# EAGLE design AEMLIC V2.1 (EAGLE 9.6.2)
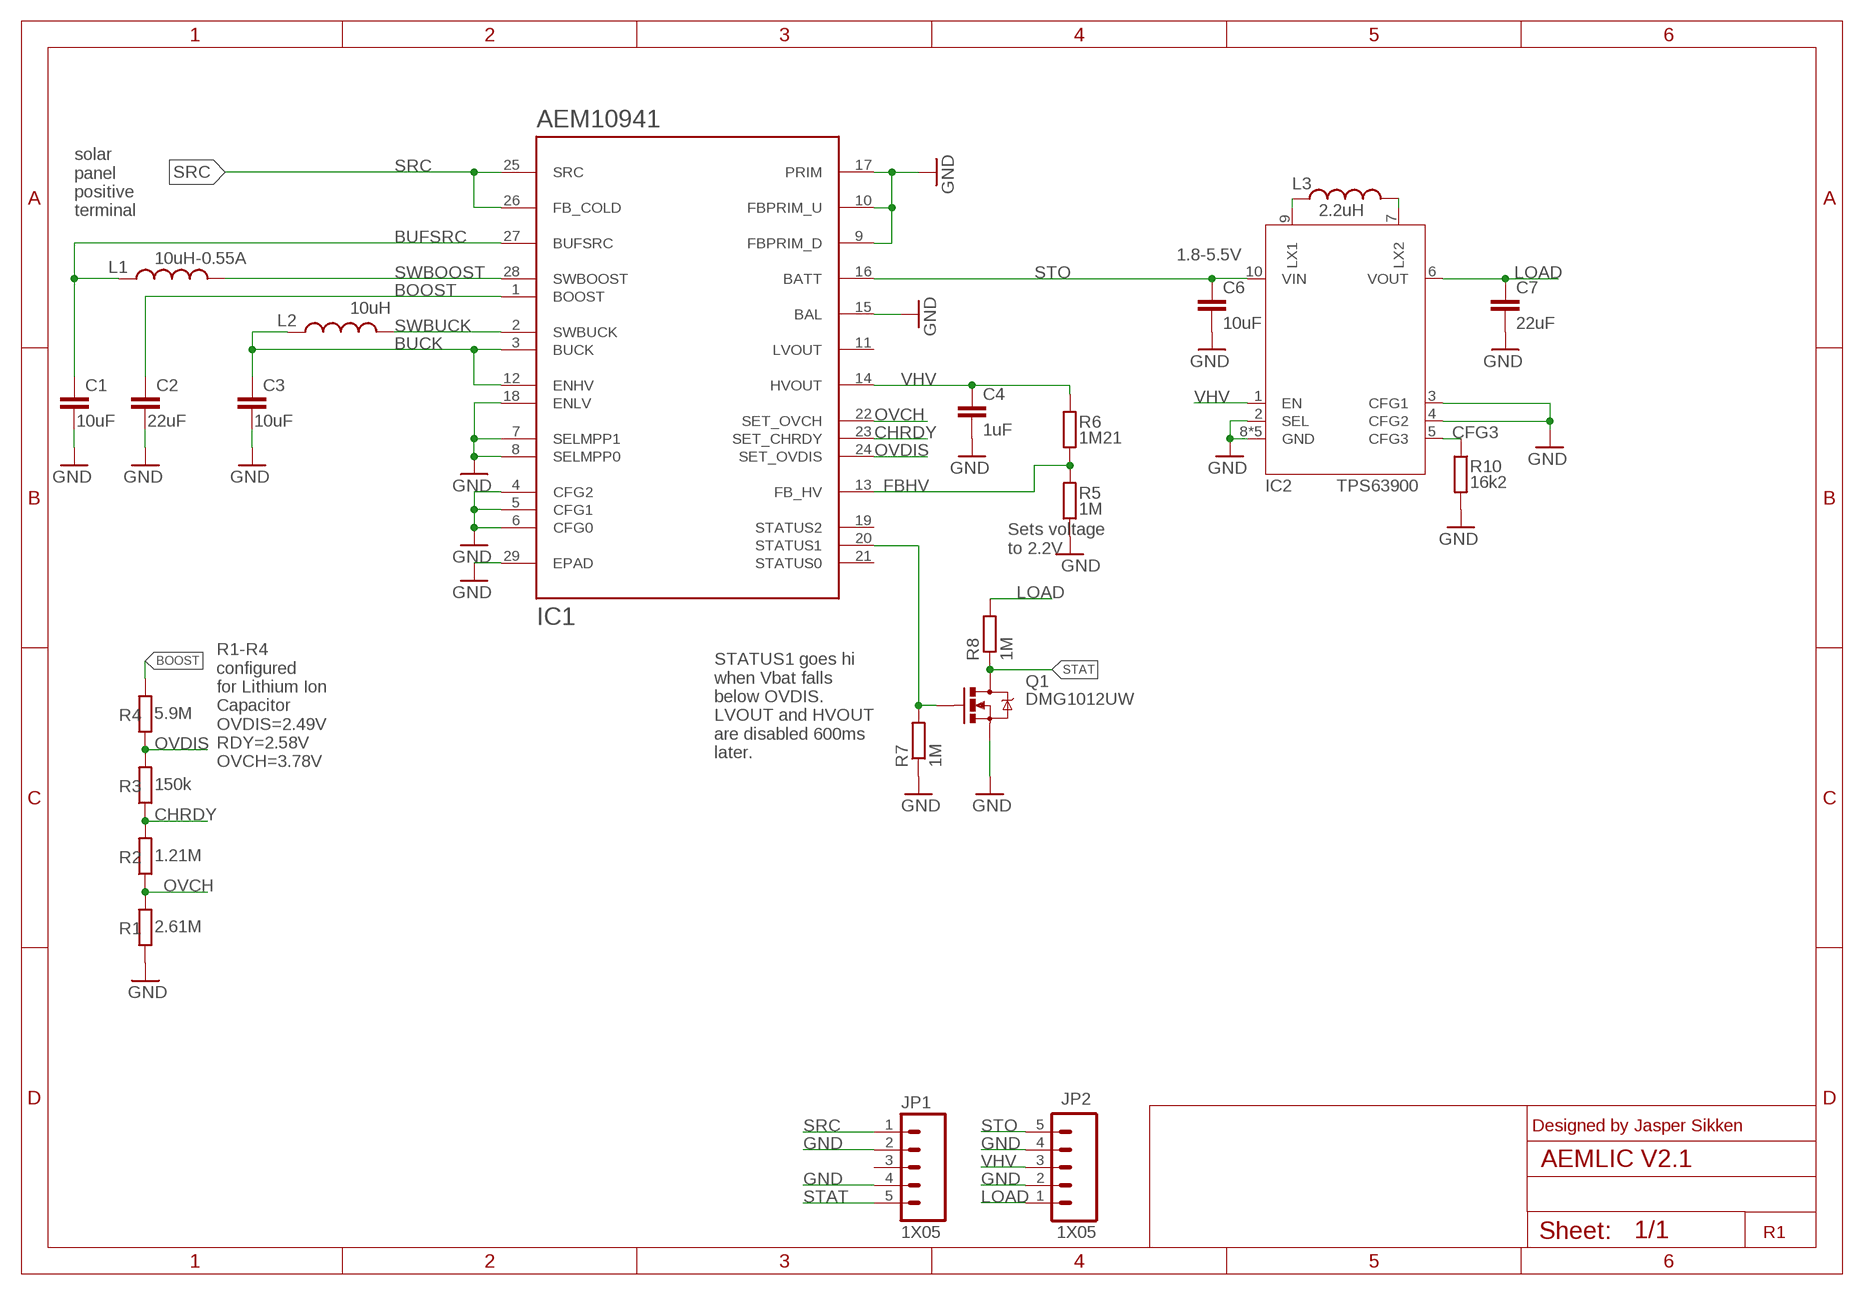
[diagram p0: schematic, sheet 1]

## Parts
C1  10uF  C0603_10UF  [C0603]
C2  22uF  C0603_22UF  [C0603]
C3  10uF  C0603_10UF  [C0603]
C4  1uF  C0603_10UF  [C0603]
C6  10uF  C0603_10UF  [C0603]
C7  22uF  C0603_22UF  [C0603]
IC1  AEM10941  [QFN50P505X505X90-28]
IC2  TPS63900  [WSON10]
JP1  1X05  [1X05_2.54MM_ROUND_NOSILK]
JP2  1X05  [1X05_2.54MM_ROUND_NOSILK]
L1  10uH-0.55A  L3.9X3.9_10UH_0.55A  [LPS4012]
L2  10uH  L0603_10UH  [L0603]
L3  2.2uH  L2  [L_1008_[2520]]
Q1  DMG1012UW  MOSFET-N-CHANNEL_DMG1012UW  [SOT323]
R1  2.61M  R0402_1M  [R0402]
R2  1.21M  R0402_1M  [R0402]
R3  150k  R0402_1M  [R0402]
R4  5.9M  R0402_1M  [R0402]
R5  1M  R0402_1M  [R0402]
R6  1M21  R0402_1M  [R0402]
R7  1M  R0402_1M  [R0402]
R8  1M  R0402_1M  [R0402]
R10  16k2  R0402_10K  [R0402]

## Nets
BOOST: C2.1 IC1.1(BOOST) R4.2
BUCK: C3.1 IC1.3(BUCK) IC1.12(ENHV) L2.1
BUFSRC: C1.1 IC1.27(BUFSRC) L1.1
CFG3: IC2.5(CFG3) R10.1
CHRDY: IC1.23(SET_CHRDY) R2.2 R3.1
FBHV: IC1.13(FB_HV) R5.2 R6.1
GND: C1.2 C2.2 C3.2 C4.2 C6.2 C7.2 IC1.4(CFG2) IC1.5(CFG1) IC1.6(CFG0) IC1.7(SELMPP1) IC1.8(SELMPP0) IC1.9(FBPRIM_D) IC1.10(FBPRIM_U) IC1.15(BAL) IC1.17(PRIM) IC1.18(ENLV) IC1.29(EPAD) IC2.2(SEL) IC2.3(CFG1) IC2.4(CFG2) IC2.8(GND) IC2.29(GND) IC2.P$2(GND) IC2.P$4(GND) IC2.P$5(GND) JP1.2 JP1.4 JP2.2 JP2.4 Q1.2(S) R1.1 R5.1 R7.1 R10.2
LOAD: C7.1 IC2.6(VOUT) JP2.1 R8.2
N$2: IC2.9(LX1) L3.1
N$3: IC2.7(LX2) L3.2
OVCH: IC1.22(SET_OVCH) R1.2 R2.1
OVDIS: IC1.24(SET_OVDIS) R3.2 R4.1
SRC: IC1.25(SRC) IC1.26(FB_COLD) JP1.1
STAT: JP1.5 Q1.3(D) R8.1
STATUS1: IC1.20(STATUS1) Q1.1(G) R7.2
STO: C6.1 IC1.16(BATT) IC2.10(VIN) JP2.5
SWBOOST: IC1.28(SWBOOST) L1.2
SWBUCK: IC1.2(SWBUCK) L2.2
VHV: C4.1 IC1.14(HVOUT) IC2.1(EN) JP2.3 R6.2
Unconnected: IC1.11(LVOUT) IC1.19(STATUS2) IC1.21(STATUS0) JP1.3

## Notes on the sheet
- solar
  panel
  positive
  terminal
- 1.8-5.5V
- Sets voltage 
  to 2.2V
- STATUS1 goes hi 
  when Vbat falls 
  below OVDIS. 
  LVOUT and HVOUT
  are disabled 600ms
  later.
- R1-R4 
  configured 
  for Lithium Ion 
  Capacitor
  OVDIS=2.49V
  RDY=2.58V
  OVCH=3.78V
- Designed by Jasper Sikken
- R1

## Library data of the parts
C1 C3 = TSEM:C: Non-polarized capacitor; FARNELL_OC: 2113070; MF: KEYSTONE; MPN: 1049P; OC_NEWARK: 53Y2625
C2 = TSEM:C: Non-polarized capacitor; FARNELL_OC: 2426957; MF: TDK; MPN: CGA5L1X7S1A226M160AC; OC_NEWARK: 71AH2845; VALUE: 22uF 10V
C4 = TSEM:C: Non-polarized capacitor; FARNELL_OC: 2113070; MF: Taiyo Yuden; MPN: LMK107BBJ106MALT; VALUE: 10uF
C6 = JaspersEagleLibrary:C: Non-polarized capacitor; FARNELL_OC: 2113070; MF: Taiyo Yuden; MPN: LMK107BBJ106MALT
C7 = JaspersEagleLibrary:C: Non-polarized capacitor; FARNELL_OC: 2426957; MF: Murata; MPN: GRM188R61A226ME15D; VALUE: 22uF 10V
IC1 = TSEM:AEM10941: Ambient Energy Manager from e-peas; OC_NEWARK: unknown
IC2 = JaspersEagleLibrary:TPS63900: TPS63900 1.8-V to 5.5-V, 75-nA IQ Buck-boost Converter with Input Current Limit and DVS
JP1 JP2 = TSEM:1X05; OC_NEWARK: unknown
L1 = TSEM:L: Inductor; FARNELL_OC: 2408076; MF: BOURNS; MPN: SRN2009T-100M; OC_NEWARK: 43AC9502
L2 = TSEM:L: Inductor; FARNELL_OC: 2215635; MF: TAIYO YUDEN; MPN: CK2125100M-T; OC_NEWARK: 25AC6883
L3 = TSEM:L: Inductor; MF: Murata; MPN: DFE252012F-2R2M=P2
Q1 = TSEM:MOSFET-N-CHANNEL: Mosfet N channel; FARNELL_OC: 2061403; OC_NEWARK: unknown
R1-R4 R6 = TSEM:R: Resistor; FARNELL_OC: 2502499; OC_NEWARK: unknown; VALUE: 1M
R5 R7 R8 = TSEM:R: Resistor; FARNELL_OC: 2502499; OC_NEWARK: unknown
R10 = JaspersEagleLibrary:R: Resistor; FARNELL_OC: 2447096; OC_NEWARK: unknown; VALUE: 10k

## Board
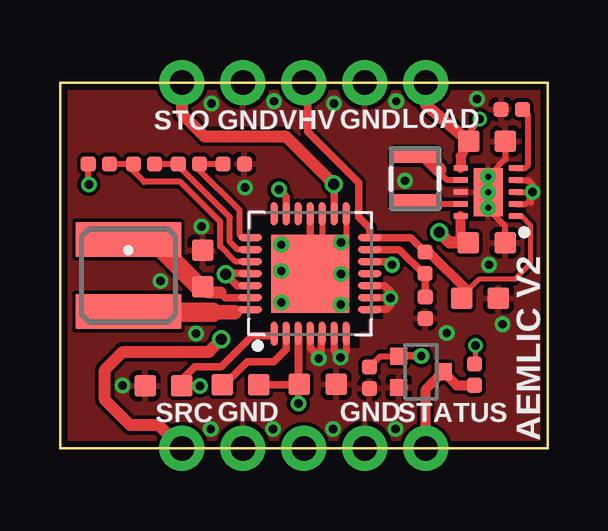
[diagram p1: board, top side]
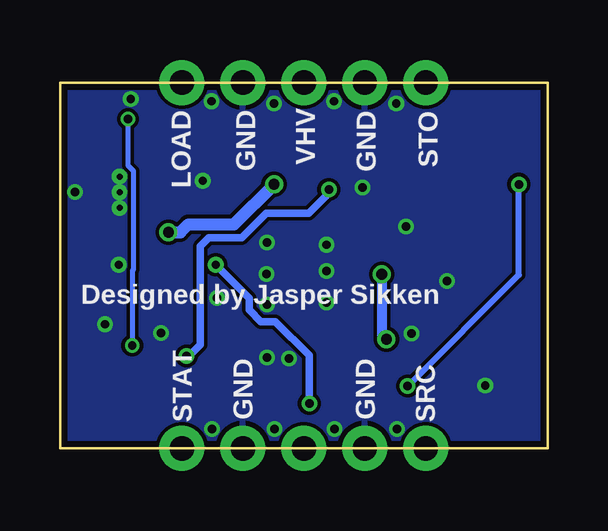
[diagram p2: board, bottom side, seen from below]

Size 20.32 x 15.24 mm. Coordinates in mm from the lower left corner, seen from the top.
Outline: 0,0 0,15.24 20.32,15.24 20.32,0 0,0
Copper layers (1*16): Top 0.018mm / dielectric 1.55mm / Bottom 0.018mm
Design rules "eC_2Layer_PClass6_BaseCopperO18_eCDefault *": minimum track width 0.15mm, minimum drill 0.35mm, track to track 0.15mm, track to pad 0.15mm, pad to pad 0.15mm, via to via 0.15mm, smd to smd 0mil, copper to edge 0.25mm, drill to drill 0.35mm, minimum pad ring 0.175mm, minimum via ring 0.125mm, stop-mask expansion 0mil, vias tented up to drill 0.45mm, thermal gap 0.2mm
tRestrict: area 12.4,5.4 to 13.4,7; area 10.2,4.2 to 11.4,5.2; area 11.7,9.7 to 12.3,10.4; area 11.3,4.2 to 12.5,5.2; area 10.2,9.3 to 11.2,10.4; area 18.4,10 to 19.3,11.4

### Footprints (pad centres in the part's own frame; a part is rotated, then mirrored left to right if it is on the bottom)
C0603 = smd 0.889 x 0.889: 1 -0.762,0; 2 0.762,0
QFN50P505X505X90-28 = smd 0.977 x 0.292: 1 -2.486,1.5; 2 -2.486,1; 3 -2.486,0.5; 4 -2.486,0; 5 -2.486,-0.5; 6 -2.486,-1; 7 -2.486,-1.5; 15 2.486,-1.5; 16 2.486,-1; 17 2.486,-0.5; 18 2.486,0; 19 2.486,0.5; 20 2.486,1; 21 2.486,1.5 | smd 0.292 x 0.977: 8 -1.5,-2.486; 9 -1,-2.486; 10 -0.5,-2.486; 11 0,-2.486; 12 0.5,-2.486; 13 1,-2.486; 14 1.5,-2.486; 22 1.5,2.486; 23 1,2.486; 24 0.5,2.486; 25 0,2.486; 26 -0.5,2.486; 27 -1,2.486; 28 -1.5,2.486 | smd 3.25 x 3.25: 29 0,0
WSON10 = smd 0.6 x 0.25: 1 -1.15,1; 2 -1.15,0.5; 3 -1.15,0; 4 -1.15,-0.5; 5 -1.15,-1; 6 1.15,-1; 7 1.15,-0.5; 8 1.15,0; 9 1.15,0.5; 10 1.15,1 | smd 1.2 x 2: 29 0,0 | drill 0.25 pad 0.65: P$2 0,0; P$4 0,-0.65; P$5 0,0.65
1X05_2.54MM_ROUND_NOSILK = drill 1.016 pad 1.88: 1 0,0; 2 2.54,0; 3 5.08,0; 4 7.62,0; 5 10.16,0
LPS4012 = smd 1.45 x 4.4: 1 -1.5,0; 2 1.5,0
L0603 = smd 0.889 x 0.889: 1 -0.762,0; 2 0.762,0
L_1008_[2520] = smd 0.6 x 2: 1 -0.95,0; 2 0.95,0
SOT323 = smd 0.7 x 0.7: 1 -0.65,-0.925; 2 0.65,-0.925; 3 0,0.925
R0402 = smd 0.635 x 0.635: 1 -0.445,0; 2 0.445,0

### Placement (x,y rotation side)
C1  5.95,7.5 90 top
C2  4.31,2.6 180 top
C3  10.74,2.66 0 top
C4  17.5,6.25 0 top
C6  17.78,8.57 0 top
C7  17.8,12.8 0 top
IC1  10.42,7.28 90 top
IC2  17.84,10.67 180 top
JP1  5.08,0 0 top
JP2  15.24,15.24 180 top
L1  2.85,7.2 270 top
L2  7.52,2.64 180 top
L3  14.8,11.24 90 top
Q1  15.04,3.19 270 top
R1  7.24,11.85 180 top
R2  5.37,11.85 180 top
R3  3.5,11.85 180 top
R4  1.62,11.85 180 top
R5  15.22,5.86 90 top
R6  15.21,7.73 90 top
R7  12.89,2.94 90 top
R8  17.27,3.07 90 top
R10  18.82,14.12 180 top

### Tracks (layer width: path | path; a pad name or v marks a point on that pad's centre or on a via)
BOOST  (via drill 0.35 pad 0.65)
  Top 0.254: v1.2,11 1.18,11.02 R4.2
  Top 0.305: 8.92,4.41 IC1.1 8.83,4.7 8.02,4.7 6.72,3.4 5.61,3.4 5.07,2.86 C2.1 v5.83,2.6
  Bottom 0.254: v5.83,2.6 1.2,7.23 v1.2,11
BUCK  (via drill 0.35 pad 0.65)
  Top 0.254: v9.93,1.87 9.93,2.88 9.94,2.89
  Top 0.305: v13.83,7.65 13.7,7.78 IC1.12 | 9.94,2.89 9.94,4.77 IC1.3 9.92,2.72 C3.1 9.96,2.64 L2.1
  Bottom 0.305: v9.93,1.87 v9.94,1.88 9.94,3.87 11.35,5.28 11.95,5.28 12.44,5.77 12.44,6.26 v13.83,7.65
BUFSRC
  Top 0.305: IC1.27 6.89,6.28 6.68,6.49
  Top 0.508: 6.68,6.49 6.19,6.49 C1.1
  Top 0.813: L1.1 3.85,8.7 5.81,6.74 C1.1
CFG3
  Top 0.254: IC2.5 19.37,11.67 19.5,11.8 19.5,13.88 R10.1
CHRDY
  Top 0.254: IC1.23 7.4,8.28 7.08,8.61 7.08,9.62 4.93,11.77 R2.2 R3.1
FBHV
  Top 0.305: 15.16,6.36 R5.2 15.21,6.31 R6.1 15.17,7.24 14.13,8.28 IC1.13
GND  (via drill 0.35 pad 0.65)
  Top 0.152: 10.04,7.85 9.57,7.38 v9.22,7.38 | 10.04,7.85 10.04,7.66 IC1.29 10.42,7.48 10.04,7.85
  Top 0.203: v19.69,10.68 19.63,10.62 19.63,10.21 | 19.89,10.68 19.38,10.17
  Top 0.254: C7.2 18.56,12.04 IC2.P$4 | C6.2 18.54,9.26 17.84,9.96 IC2.P$5 | IC2.4 19.5,11.17 19.69,10.98 v19.69,10.68 19.72,10.68 | IC2.3 19.71,10.67 19.72,10.68 | 19.89,10.68 19.72,10.68 | IC2.2 19.38,10.17 | IC1.15 11.92,8.79 v11.7,8.57 | IC1.29 10.42,7.87 11.12,8.57 10.92,8.77 IC1.17
  Top 0.3: IC1.7 11.92,4.01 v11.69,3.78
  Top 0.305: 11.42,6.28 IC1.29 | IC1.4 10.42,4.18 10.78,3.82 v10.78,3.75 10.89,3.86 10.89,4.76 IC1.5 | IC1.6 11.42,4.06 v11.69,3.79 v11.69,3.78 | IC1.18 10.42,8.66 10.24,8.48 v9.22,8.48 | IC1.10 13.52,6.78 13.77,6.53 v13.77,6.27 | IC1.9 v13.76,6.28 v13.77,6.27 | v13.77,6.27 13.77,5.97 13.6,5.8 12.93,5.8 IC1.8
  Top 0.508: IC1.29 v11.7,8.57
  other vias: 9.22,6.08 11.7,6 11.71,7.27 7.71,10.86 2.6,2.62 5.67,4.78 4.19,6.97 5.9,9.25 8.91,14.46 6.31,14.36 11.41,14.36 14.01,14.46 6.28,0.81 8.88,0.81 11.38,0.81 13.98,0.81 17.37,14.56 18.44,5.17 17.87,7.65 14.37,11.15 16.11,4.81
  pour Top: 0,15.24 20.32,15.24 20.32,0 0,0
  pour Bottom: 0,15.24 20.32,15.24 20.32,0 0,0
LOAD  (via drill 0.35)
  Top 0.203: C7.1 17.04,13.18 17.49,13.63 v17.49,13.72 | v17.31,4.29 17.31,3.55 R8.2
  Top 0.406: C7.1 16.69,12.17 IC2.6
  Top 0.508: JP2.1 15.24,14.32 C7.1
  Bottom 0.203: v17.49,13.72 17.49,11.79 17.26,11.56 17.26,7.45 17.3,7.41 v17.3,4.29 v17.31,4.29
N$2
  Top 0.254: IC2.9 14.92,10.17 L3.1
N$3
  Top 0.254: IC2.7 16.13,11.17 15.8,11.5 15.8,11.6
  Top 0.61: 15.11,12.19 L3.2 15.21,12.19 15.8,11.6
OVCH
  Top 0.254: IC1.22 7.59,8.78 7.48,8.89 7.48,9.92 5.7,11.7 5.7,11.74 R2.1 R1.2
OVDIS
  Top 0.254: IC1.24 7.31,7.78 6.67,8.42 6.67,9.43 5,11.1 3.5,11.1 3,11.6 3,11.79 3,11.8 | 3,11.8 R3.2 | R4.1 2.95,11.85 3,11.8
SRC  (via drill 0.45 pad 0.75)
  Top 0.305: IC1.25 6.95,7.29 v6.91,7.25 7.38,6.78 IC1.26
  Top 0.508: JP1.1 4.11,0.97 2.93,0.97 1.87,2.03 1.87,3.27 2.62,4.02 6.2,4.02 v6.72,4.54
  Bottom 0.406: v6.91,7.25 6.91,4.73 v6.72,4.54
STAT
  Top 0.406: JP1.5 15.24,2.46 Q1.3 16.53,2.63 R8.1
STATUS1  (via drill 0.35 pad 0.65)
  Top 0.254: R7.2 13.34,3.84 Q1.1
  Top 0.305: IC1.20 9.42,10.48 v9.12,10.78 | v15.05,3.85 14.13,3.85 Q1.1
  Bottom 0.305: v9.12,10.78 9.12,10.62 9.95,9.79 11.73,9.79 12.75,8.77 14.12,8.77 14.48,8.42 14.48,4.32 15,3.8 v15.05,3.85
STO  (via drill 0.45 pad 0.75)
  Top 0.305: IC1.16 11.42,10.98 v11.4,11 | C6.1 16.69,8.9
  Top 0.406: 16.69,8.9 IC2.10
  Top 0.508: JP2.5 5.08,13.94 6.02,13 9.4,13 v11.4,11 | C6.1 16.23,8.57 v15.8,9
  Bottom 0.508: v15.8,9 15.3,9 14.97,9.33 13.07,9.33 v11.4,11
SWBOOST
  Top 0.305: L1.2 2.82,5.67 | IC1.28 7.39,5.78 7.28,5.67
  Top 0.61: 7.28,5.67 6.36,5.67
  Top 0.813: 6.36,5.67 2.82,5.67
SWBUCK
  Top 0.305: L2.2 6.84,2.64 7.8,3.6 8.9,3.6 9.42,4.12 IC1.2
VHV
  Top 0.203: IC2.1 19.23,9.67 19.6,9.3 19.6,7.7 18.94,7.04 17.44,7.04 16.93,6.53
  Top 0.305: JP2.3 10.33,15.07 10.33,13.18 12.45,11.06 12.45,9.63 12.91,9.17 IC1.14 14.6,8.78 R6.2 | 16.93,6.53 C4.1
  Top 0.406: C4.1 16.93,6.62 15.37,8.18 R6.2

### Text on the board
tPlace: STO | GND | VHV | GND | LOAD | SRC | GND | GND | STATUS | AEMLIC V2
bPlace: STO | GND | VHV | GND | LOAD | Designed by Jasper Sikken | SRC | GND | GND | STAT